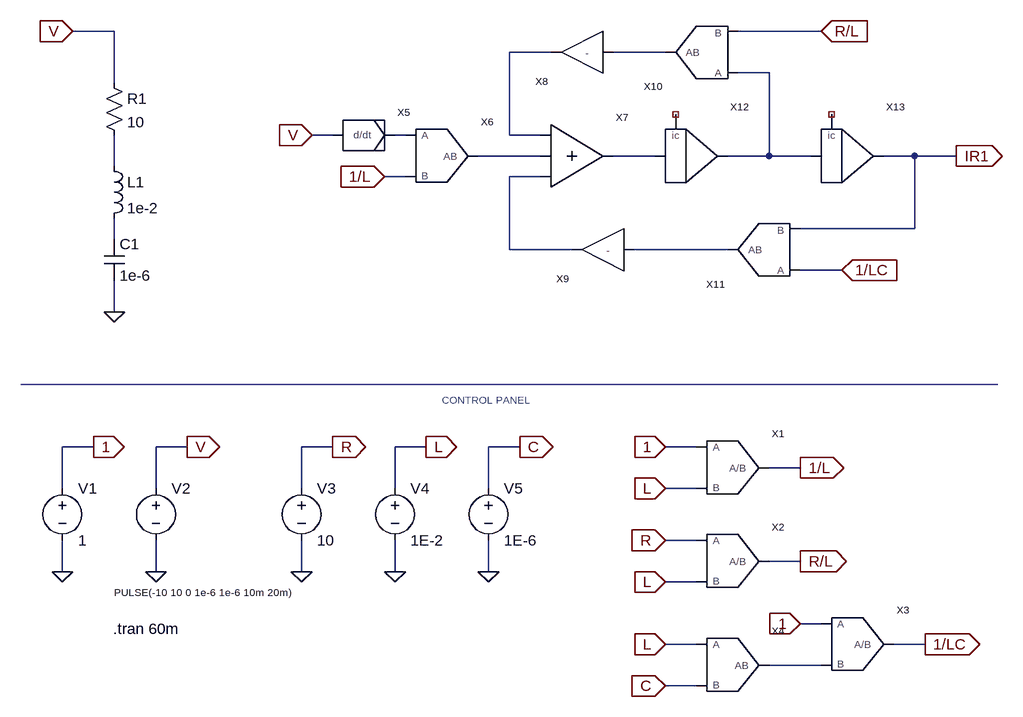
[diagram p0: schematic Glazar_Figure6.asc]
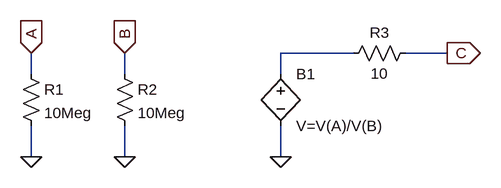
[diagram p1: sub-circuit divider5.asc]
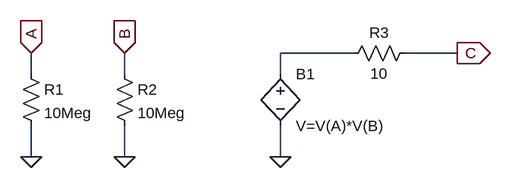
[diagram p2: sub-circuit multiplier5.asc]
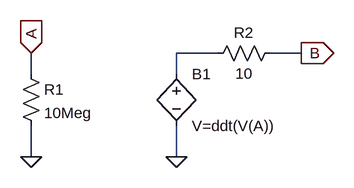
[diagram p3: sub-circuit differentiator5.asc]
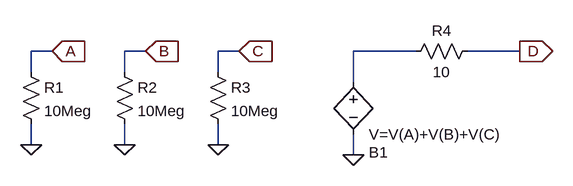
[diagram p4: sub-circuit 3summer5.asc]
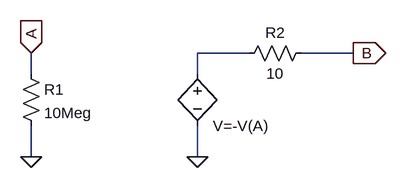
[diagram p5: sub-circuit inverter5.asc]
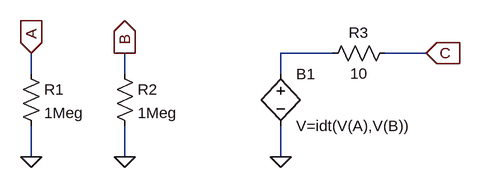
[diagram p6: sub-circuit integrator5.asc]
Glazar_Figure6.asc, the LTspice schematic file:
Version 4
SHEET 1 1748 680
WIRE -16 -544 -80 -544
WIRE 1072 -544 944 -544
WIRE 656 -512 592 -512
WIRE 832 -512 752 -512
WIRE 992 -480 944 -480
WIRE -16 -464 -16 -544
WIRE 320 -384 288 -384
WIRE 432 -384 416 -384
WIRE 592 -384 592 -512
WIRE 640 -384 592 -384
WIRE 640 -352 544 -352
WIRE 816 -352 752 -352
WIRE 992 -352 992 -480
WIRE 992 -352 928 -352
WIRE 1056 -352 992 -352
WIRE 1216 -352 1168 -352
WIRE 1280 -352 1216 -352
WIRE -16 -336 -16 -384
WIRE 432 -320 400 -320
WIRE 640 -320 592 -320
WIRE 1216 -240 1216 -352
WIRE 1216 -240 1040 -240
WIRE -16 -224 -16 -256
WIRE 592 -208 592 -320
WIRE 688 -208 592 -208
WIRE 928 -208 784 -208
WIRE 1104 -176 1040 -176
WIRE -16 -112 -16 -160
WIRE -48 96 -96 96
WIRE 96 96 48 96
WIRE 320 96 272 96
WIRE 464 96 416 96
WIRE 608 96 560 96
WIRE 880 96 832 96
WIRE 1040 128 992 128
WIRE -96 160 -96 96
WIRE 48 160 48 96
WIRE 272 160 272 96
WIRE 416 160 416 96
WIRE 560 160 560 96
WIRE 880 160 832 160
WIRE 880 240 832 240
WIRE 1040 272 992 272
WIRE -96 288 -96 240
WIRE 48 288 48 240
WIRE 272 288 272 240
WIRE 416 288 416 240
WIRE 560 288 560 240
WIRE 880 304 832 304
WIRE 1072 368 1040 368
WIRE 880 400 832 400
WIRE 1232 400 1184 400
WIRE 1072 432 992 432
WIRE 880 464 832 464
FLAG -96 288 0
FLAG 48 288 0
FLAG 272 288 0
FLAG 416 288 0
FLAG 560 288 0
FLAG -48 96 1
IOPIN -48 96 Out
FLAG 96 96 V
IOPIN 96 96 Out
FLAG 320 96 R
IOPIN 320 96 Out
FLAG 464 96 L
IOPIN 464 96 Out
FLAG 608 96 C
IOPIN 608 96 Out
FLAG 832 96 1
IOPIN 832 96 In
FLAG 832 160 L
IOPIN 832 160 In
FLAG 1040 128 1/L
IOPIN 1040 128 Out
FLAG 832 240 R
IOPIN 832 240 In
FLAG 832 304 L
IOPIN 832 304 In
FLAG 1040 272 R/L
IOPIN 1040 272 Out
FLAG 1040 368 1
IOPIN 1040 368 In
FLAG 832 400 L
IOPIN 832 400 In
FLAG 1232 400 1/LC
IOPIN 1232 400 Out
FLAG 832 464 C
IOPIN 832 464 In
FLAG -16 -112 0
FLAG -80 -544 V
IOPIN -80 -544 In
FLAG 1072 -544 R/L
IOPIN 1072 -544 In
FLAG 288 -384 V
IOPIN 288 -384 In
FLAG 400 -320 1/L
IOPIN 400 -320 In
FLAG 1104 -176 1/LC
IOPIN 1104 -176 In
FLAG 1280 -352 IR1
IOPIN 1280 -352 Out
SYMBOL voltage -96 144 R0
WINDOW 123 0 0 Left 0
WINDOW 39 0 0 Left 0
SYMATTR InstName V1
SYMATTR Value 1
SYMBOL voltage 48 144 R0
WINDOW 3 -64 176 Left 1
WINDOW 123 0 0 Left 0
WINDOW 39 0 0 Left 0
SYMATTR InstName V2
SYMATTR Value PULSE(-10 10 0 1e-6 1e-6 10m 20m)
SYMBOL voltage 272 144 R0
WINDOW 123 0 0 Left 0
WINDOW 39 0 0 Left 0
SYMATTR InstName V3
SYMATTR Value 10
SYMBOL voltage 416 144 R0
WINDOW 123 0 0 Left 0
WINDOW 39 0 0 Left 0
SYMATTR InstName V4
SYMATTR Value 1E-2
SYMBOL voltage 560 144 R0
WINDOW 123 0 0 Left 0
WINDOW 39 0 0 Left 0
SYMATTR InstName V5
SYMATTR Value 1E-6
SYMBOL MyComponents\\Divider5 928 128 R0
SYMATTR InstName X1
SYMBOL MyComponents\\Divider5 928 272 R0
SYMATTR InstName X2
SYMBOL MyComponents\\Divider5 1120 400 R0
SYMATTR InstName X3
SYMBOL MyComponents\\Multiplier5 928 432 R0
SYMATTR InstName X4
SYMBOL cap -32 -224 R0
SYMATTR InstName C1
SYMATTR Value 1e-6
SYMBOL res -32 -480 R0
SYMATTR InstName R1
SYMATTR Value 10
SYMBOL ind -32 -352 R0
SYMATTR InstName L1
SYMATTR Value 1e-2
SYMBOL MyComponents\\Differentiator5 368 -384 R0
SYMATTR InstName X5
SYMBOL MyComponents\\Multiplier5 480 -352 R0
SYMATTR InstName X6
SYMBOL MyComponents\\3Summer5 688 -352 R0
SYMATTR InstName X7
SYMBOL MyComponents\\Inverter5 704 -512 R180
SYMATTR InstName X8
SYMBOL MyComponents\\Inverter5 736 -208 R180
SYMATTR InstName X9
SYMBOL MyComponents\\Multiplier5 896 -512 R180
SYMATTR InstName X10
SYMBOL MyComponents\\Multiplier5 992 -208 R180
SYMATTR InstName X11
SYMBOL MyComponents\\Integrator5 864 -352 R0
SYMATTR InstName X12
SYMBOL MyComponents\\Integrator5 1104 -352 R0
SYMATTR InstName X13
TEXT -18 376 Left 2 !.tran 60m
TEXT 488 24 Left 1 ;CONTROL PANEL
LINE Normal 1344 0 -160 0

divider5.asc, the sub-circuit schematic file:
Version 4
SHEET 1 880 680
WIRE 416 80 304 80
WIRE 560 80 496 80
WIRE -80 112 -80 80
WIRE 64 112 64 80
WIRE 304 112 304 80
WIRE -80 240 -80 192
WIRE 64 240 64 192
WIRE 304 240 304 192
FLAG -80 80 A
IOPIN -80 80 In
FLAG 64 80 B
IOPIN 64 80 In
FLAG -80 240 0
FLAG 64 240 0
FLAG 304 240 0
FLAG 560 80 C
IOPIN 560 80 Out
SYMBOL bv 304 96 R0
SYMATTR InstName B1
SYMATTR Value V=V(A)/V(B)
SYMBOL res -96 96 R0
SYMATTR InstName R1
SYMATTR Value 10Meg
SYMBOL res 48 96 R0
SYMATTR InstName R2
SYMATTR Value 10Meg
SYMBOL res 512 64 R90
WINDOW 0 0 56 VBottom 2
WINDOW 3 32 56 VTop 2
SYMATTR InstName R3
SYMATTR Value 10

multiplier5.asc, the sub-circuit schematic file:
Version 4
SHEET 1 880 680
WIRE 416 80 304 80
WIRE 576 80 496 80
WIRE -80 112 -80 80
WIRE 64 112 64 80
WIRE 304 112 304 80
WIRE -80 240 -80 192
WIRE 64 240 64 192
WIRE 304 240 304 192
FLAG -80 80 A
IOPIN -80 80 In
FLAG 64 80 B
IOPIN 64 80 In
FLAG -80 240 0
FLAG 64 240 0
FLAG 304 240 0
FLAG 576 80 C
IOPIN 576 80 Out
SYMBOL bv 304 96 R0
SYMATTR InstName B1
SYMATTR Value V=V(A)*V(B)
SYMBOL res -96 96 R0
SYMATTR InstName R1
SYMATTR Value 10Meg
SYMBOL res 48 96 R0
SYMATTR InstName R2
SYMATTR Value 10Meg
SYMBOL res 512 64 R90
WINDOW 0 0 56 VBottom 2
WINDOW 3 32 56 VTop 2
SYMATTR InstName R3
SYMATTR Value 10

differentiator5.asc, the sub-circuit schematic file:
Version 4
SHEET 1 880 680
WIRE 0 80 -64 80
WIRE 128 80 80 80
WIRE -288 112 -288 80
WIRE -64 112 -64 80
WIRE -288 240 -288 192
WIRE -64 240 -64 192
FLAG -64 240 0
FLAG 128 80 B
IOPIN 128 80 Out
FLAG -288 80 A
IOPIN -288 80 In
FLAG -288 240 0
SYMBOL bv -64 96 R0
SYMATTR InstName B1
SYMATTR Value V=ddt(V(A))
SYMBOL res -304 96 R0
SYMATTR InstName R1
SYMATTR Value 10Meg
SYMBOL res 96 64 R90
WINDOW 0 0 56 VBottom 2
WINDOW 3 32 56 VTop 2
SYMATTR InstName R2
SYMATTR Value 10

3summer5.asc, the sub-circuit schematic file:
Version 4
SHEET 1 880 680
WIRE -96 64 -128 64
WIRE 48 64 16 64
WIRE 192 64 160 64
WIRE 464 64 368 64
WIRE 624 64 544 64
WIRE -128 96 -128 64
WIRE 16 96 16 64
WIRE 160 96 160 64
WIRE 368 112 368 64
WIRE -128 208 -128 176
WIRE 16 208 16 176
WIRE 160 208 160 176
WIRE 368 224 368 192
FLAG 368 224 0
FLAG 624 64 D
IOPIN 624 64 Out
FLAG -128 208 0
FLAG 16 208 0
FLAG 160 208 0
FLAG -96 64 A
IOPIN -96 64 In
FLAG 48 64 B
IOPIN 48 64 In
FLAG 192 64 C
IOPIN 192 64 In
SYMBOL bv 368 96 R0
WINDOW 0 24 124 Left 2
SYMATTR InstName B1
SYMATTR Value V=V(A)+V(B)+V(C)
SYMBOL res -144 80 R0
SYMATTR InstName R1
SYMATTR Value 10Meg
SYMBOL res 0 80 R0
SYMATTR InstName R2
SYMATTR Value 10Meg
SYMBOL res 144 80 R0
SYMATTR InstName R3
SYMATTR Value 10Meg
SYMBOL res 560 48 R90
WINDOW 0 0 56 VBottom 2
WINDOW 3 32 56 VTop 2
SYMATTR InstName R4
SYMATTR Value 10

inverter5.asc, the sub-circuit schematic file:
Version 4
SHEET 1 880 680
WIRE 272 80 192 80
WIRE 432 80 352 80
WIRE -64 112 -64 80
WIRE 192 112 192 80
WIRE -64 240 -64 192
WIRE 192 240 192 192
FLAG 432 80 B
IOPIN 432 80 Out
FLAG 192 240 0
FLAG -64 80 A
IOPIN -64 80 In
FLAG -64 240 0
SYMBOL bv 192 96 R0
WINDOW 0 24 16 Invisible 2
SYMATTR InstName B1
SYMATTR Value V=-V(A)
SYMBOL res -80 96 R0
SYMATTR InstName R1
SYMATTR Value 10Meg
SYMBOL res 368 64 R90
WINDOW 0 0 56 VBottom 2
WINDOW 3 32 56 VTop 2
SYMATTR InstName R2
SYMATTR Value 10

integrator5.asc, the sub-circuit schematic file:
Version 4
SHEET 1 880 680
WIRE 384 80 304 80
WIRE 528 80 464 80
WIRE -80 112 -80 80
WIRE 64 112 64 80
WIRE 304 112 304 80
WIRE -80 240 -80 192
WIRE 64 240 64 192
WIRE 304 240 304 192
FLAG -80 80 A
IOPIN -80 80 In
FLAG -80 240 0
FLAG 64 240 0
FLAG 304 240 0
FLAG 64 80 B
IOPIN 64 80 Out
FLAG 528 80 C
IOPIN 528 80 In
SYMBOL bv 304 96 R0
SYMATTR InstName B1
SYMATTR Value V=idt(V(A),V(B))
SYMBOL res -96 96 R0
SYMATTR InstName R1
SYMATTR Value 1Meg
SYMBOL res 48 96 R0
SYMATTR InstName R2
SYMATTR Value 1Meg
SYMBOL res 480 64 R90
WINDOW 0 0 56 VBottom 2
WINDOW 3 32 56 VTop 2
SYMATTR InstName R3
SYMATTR Value 10

The netlist it stands for:
* Glazar_Figure6.asc
V1 1 0 1
V2 V 0 PULSE(-10 10 0 1e-6 1e-6 10m 20m)
V3 R 0 10
V4 L 0 1E-2
V5 C 0 1E-6
XX1 1 L 1/L divider5
XX2 R L R/L divider5
XX3 1 N011 1/LC divider5
XX4 L C N011 multiplier5
C1 N009 0 1e-6
R1 V N007 10
L1 N007 N009 1e-2
XX5 V N004 differentiator5
XX6 N004 1/L N005 multiplier5
XX7 N001 N005 N006 N008 3summer5
XX8 N002 N001 inverter5
XX9 N010 N008 inverter5
XX10 N003 R/L N002 multiplier5
XX11 1/LC IR1 N010 multiplier5
XX12 N006 NC_01 N003 integrator5
XX13 N003 NC_02 IR1 integrator5

* block symbol definitions
.subckt divider5 A B C
B1 N001 0 V=V(A)/V(B)
R1 A 0 10Meg
R2 B 0 10Meg
R3 C N001 10
.ends divider5

.subckt multiplier5 A B C
B1 N001 0 V=V(A)*V(B)
R1 A 0 10Meg
R2 B 0 10Meg
R3 C N001 10
.ends multiplier5

.subckt differentiator5 A B
B1 N001 0 V=ddt(V(A))
R1 A 0 10Meg
R2 B N001 10
.ends differentiator5

.subckt 3summer5 A B D C
B1 N001 0 V=V(A)+V(B)+V(C)
R1 A 0 10Meg
R2 B 0 10Meg
R3 C 0 10Meg
R4 D N001 10
.ends 3summer5

.subckt inverter5 A B
B1 N001 0 V=-V(A)
R1 A 0 10Meg
R2 B N001 10
.ends inverter5

.subckt integrator5 A B C
B1 N001 0 V=idt(V(A),V(B))
R1 A 0 1Meg
R2 B 0 1Meg
R3 C N001 10
.ends integrator5

.tran 60m
* CONTROL PANEL
.backanno
.end